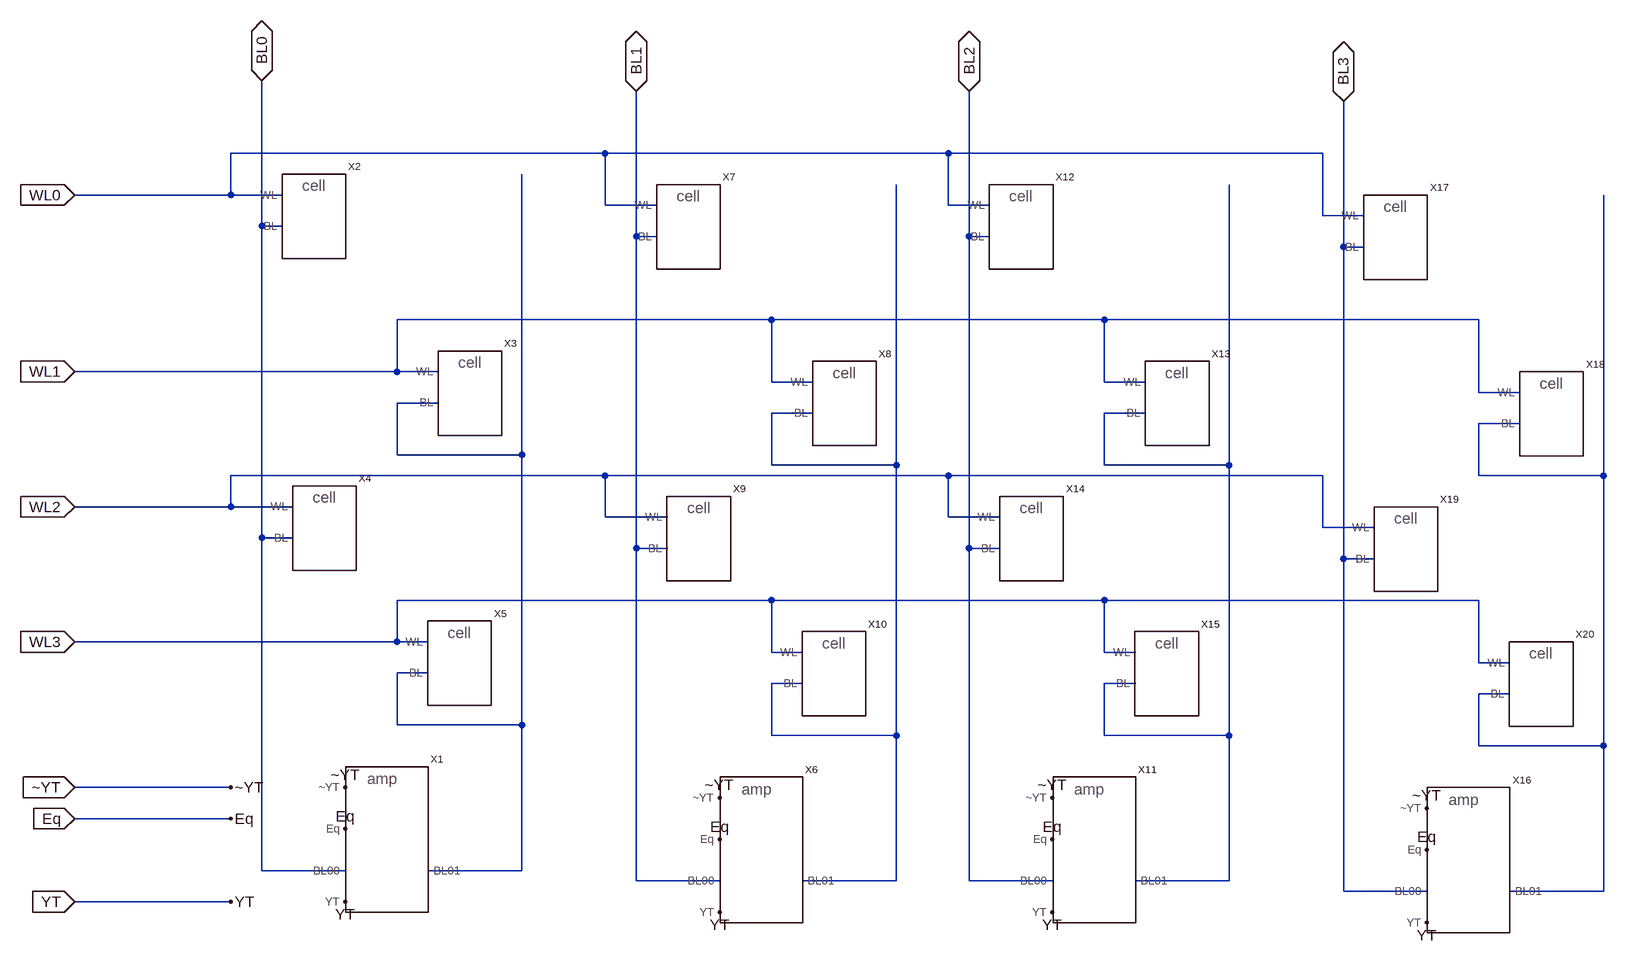
[diagram p0: schematic folded_bitline_array.asc]
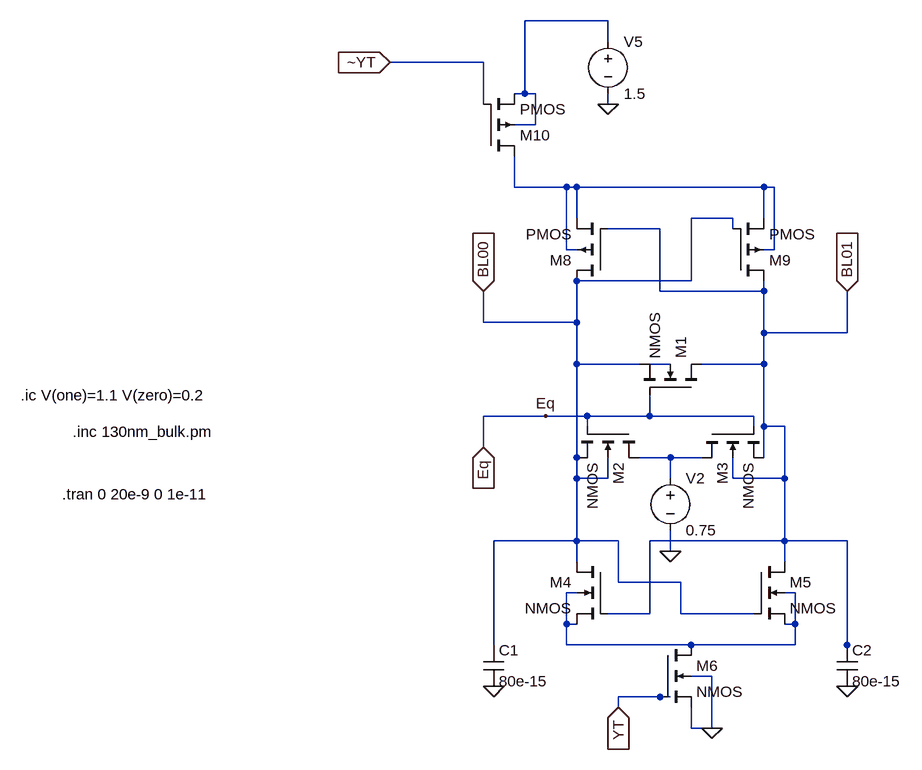
[diagram p1: sub-circuit amplifaer.asc]
folded_bitline_array.asc, the LTspice schematic file:
Version 4
SHEET 1 1560 900
WIRE 16 -528 -560 -528
WIRE 544 -528 16 -528
WIRE 1120 -528 544 -528
WIRE -560 -464 -560 -528
WIRE -560 -464 -800 -464
WIRE -480 -464 -560 -464
WIRE 16 -448 16 -528
WIRE 96 -448 16 -448
WIRE 544 -448 544 -528
WIRE 608 -448 544 -448
WIRE 1120 -432 1120 -528
WIRE 1184 -432 1120 -432
WIRE -512 -416 -512 -640
WIRE -480 -416 -512 -416
WIRE 64 -400 64 -624
WIRE 96 -400 64 -400
WIRE 576 -400 576 -624
WIRE 608 -400 576 -400
WIRE 1152 -384 1152 -608
WIRE 1184 -384 1152 -384
WIRE 272 -272 -304 -272
WIRE 784 -272 272 -272
WIRE 1360 -272 784 -272
WIRE -304 -192 -304 -272
WIRE -304 -192 -800 -192
WIRE -240 -192 -304 -192
WIRE 272 -176 272 -272
WIRE 336 -176 272 -176
WIRE 784 -176 784 -272
WIRE 848 -176 784 -176
WIRE 1360 -160 1360 -272
WIRE 1424 -160 1360 -160
WIRE -240 -144 -304 -144
WIRE 336 -128 272 -128
WIRE 848 -128 784 -128
WIRE 1424 -112 1360 -112
WIRE -304 -64 -304 -144
WIRE -112 -64 -112 -496
WIRE -112 -64 -304 -64
WIRE 272 -48 272 -128
WIRE 464 -48 464 -480
WIRE 464 -48 272 -48
WIRE 784 -48 784 -128
WIRE 976 -48 976 -480
WIRE 976 -48 784 -48
WIRE 16 -32 -560 -32
WIRE 544 -32 16 -32
WIRE 1120 -32 544 -32
WIRE 1360 -32 1360 -112
WIRE 1552 -32 1552 -464
WIRE 1552 -32 1360 -32
WIRE -560 16 -560 -32
WIRE -560 16 -800 16
WIRE -464 16 -560 16
WIRE 16 32 16 -32
WIRE 112 32 16 32
WIRE 544 32 544 -32
WIRE 624 32 544 32
WIRE 1120 48 1120 -32
WIRE 1200 48 1120 48
WIRE -512 64 -512 -416
WIRE -464 64 -512 64
WIRE 64 80 64 -400
WIRE 112 80 64 80
WIRE 576 80 576 -400
WIRE 624 80 576 80
WIRE 1152 96 1152 -384
WIRE 1200 96 1152 96
WIRE 272 160 -304 160
WIRE 784 160 272 160
WIRE 1360 160 784 160
WIRE -304 224 -304 160
WIRE -304 224 -800 224
WIRE -256 224 -304 224
WIRE 272 240 272 160
WIRE 320 240 272 240
WIRE 784 240 784 160
WIRE 832 240 784 240
WIRE 1360 256 1360 160
WIRE 1408 256 1360 256
WIRE -256 272 -304 272
WIRE 320 288 272 288
WIRE 832 288 784 288
WIRE 1408 304 1360 304
WIRE -304 352 -304 272
WIRE -112 352 -112 -64
WIRE -112 352 -304 352
WIRE 272 368 272 288
WIRE 464 368 464 -48
WIRE 464 368 272 368
WIRE 784 368 784 288
WIRE 976 368 976 -48
WIRE 976 368 784 368
WIRE 1360 384 1360 304
WIRE 1552 384 1552 -32
WIRE 1552 384 1360 384
WIRE -560 448 -800 448
WIRE -560 496 -800 496
WIRE -512 576 -512 64
WIRE -384 576 -512 576
WIRE -112 576 -112 352
WIRE -112 576 -256 576
WIRE 64 592 64 80
WIRE 192 592 64 592
WIRE 464 592 464 368
WIRE 464 592 320 592
WIRE 576 592 576 80
WIRE 704 592 576 592
WIRE 976 592 976 368
WIRE 976 592 832 592
WIRE 1152 608 1152 96
WIRE 1280 608 1152 608
WIRE 1552 608 1552 384
WIRE 1552 608 1408 608
WIRE -560 624 -800 624
FLAG -800 -464 WL0
IOPIN -800 -464 In
FLAG -800 -192 WL1
IOPIN -800 -192 In
FLAG -800 16 WL2
IOPIN -800 16 In
FLAG -800 224 WL3
IOPIN -800 224 In
FLAG -512 -640 BL0
IOPIN -512 -640 BiDir
FLAG 64 -624 BL1
IOPIN 64 -624 BiDir
FLAG 576 -624 BL2
IOPIN 576 -624 BiDir
FLAG 1152 -608 BL3
IOPIN 1152 -608 BiDir
FLAG -560 448 ~YT
FLAG -384 448 ~YT
FLAG 192 464 ~YT
FLAG 704 464 ~YT
FLAG 1280 480 ~YT
FLAG -384 512 Eq
FLAG 192 528 Eq
FLAG 704 528 Eq
FLAG 1280 544 Eq
FLAG -560 496 Eq
FLAG -560 624 YT
FLAG -384 624 YT
FLAG 192 640 YT
FLAG 704 640 YT
FLAG 1280 656 YT
FLAG -800 448 ~YT
IOPIN -800 448 In
FLAG -800 496 Eq
IOPIN -800 496 In
FLAG -800 624 YT
IOPIN -800 624 In
SYMBOL amplifaer -272 480 R0
SYMATTR InstName X1
SYMBOL memory_cell -400 -432 R0
SYMATTR InstName X2
SYMBOL memory_cell -160 -160 R0
SYMATTR InstName X3
SYMBOL memory_cell -384 48 R0
SYMATTR InstName X4
SYMBOL memory_cell -176 256 R0
SYMATTR InstName X5
SYMBOL amplifaer 304 496 R0
SYMATTR InstName X6
SYMBOL memory_cell 176 -416 R0
SYMATTR InstName X7
SYMBOL memory_cell 416 -144 R0
SYMATTR InstName X8
SYMBOL memory_cell 192 64 R0
SYMATTR InstName X9
SYMBOL memory_cell 400 272 R0
SYMATTR InstName X10
SYMBOL amplifaer 816 496 R0
SYMATTR InstName X11
SYMBOL memory_cell 688 -416 R0
SYMATTR InstName X12
SYMBOL memory_cell 928 -144 R0
SYMATTR InstName X13
SYMBOL memory_cell 704 64 R0
SYMATTR InstName X14
SYMBOL memory_cell 912 272 R0
SYMATTR InstName X15
SYMBOL amplifaer 1392 512 R0
SYMATTR InstName X16
SYMBOL memory_cell 1264 -400 R0
SYMATTR InstName X17
SYMBOL memory_cell 1504 -128 R0
SYMATTR InstName X18
SYMBOL memory_cell 1280 80 R0
SYMATTR InstName X19
SYMBOL memory_cell 1488 288 R0
SYMATTR InstName X20

amplifaer.asc, the sub-circuit schematic file:
Version 4
SHEET 1 880 680
WIRE 208 -544 80 -544
WIRE 208 -512 208 -544
WIRE 16 -480 -128 -480
WIRE 80 -432 80 -544
WIRE 80 -432 64 -432
WIRE 96 -432 80 -432
WIRE 16 -416 16 -480
WIRE 208 -416 208 -432
WIRE 96 -384 96 -432
WIRE 96 -384 64 -384
WIRE 64 -288 64 -336
WIRE 144 -288 64 -288
WIRE 160 -288 144 -288
WIRE 448 -288 160 -288
WIRE 464 -288 448 -288
WIRE 160 -240 160 -288
WIRE 400 -240 336 -240
WIRE 448 -240 448 -288
WIRE 288 -224 208 -224
WIRE 400 -224 400 -240
WIRE 144 -192 144 -288
WIRE 160 -192 144 -192
WIRE 464 -192 464 -288
WIRE 464 -192 448 -192
WIRE 336 -144 336 -240
WIRE 336 -144 160 -144
WIRE 288 -128 288 -224
WIRE 448 -128 448 -144
WIRE 448 -128 288 -128
WIRE 16 -80 16 -128
WIRE 160 -80 160 -144
WIRE 160 -80 16 -80
WIRE 448 -64 448 -128
WIRE 576 -64 576 -128
WIRE 576 -64 448 -64
WIRE 160 -16 160 -80
WIRE 256 -16 160 -16
WIRE 304 -16 272 -16
WIRE 448 -16 448 -64
WIRE 448 -16 352 -16
WIRE 112 64 16 64
WIRE 176 64 112 64
WIRE 272 64 272 32
WIRE 272 64 176 64
WIRE 432 64 272 64
WIRE 176 80 176 64
WIRE 432 80 432 64
WIRE 448 80 448 -16
WIRE 480 80 448 80
WIRE 16 112 16 64
WIRE 160 128 160 -16
WIRE 304 128 256 128
WIRE 352 128 304 128
WIRE 448 128 448 80
WIRE 160 160 160 128
WIRE 208 160 208 128
WIRE 208 160 160 160
WIRE 304 160 304 128
WIRE 400 160 400 128
WIRE 480 160 480 80
WIRE 480 160 400 160
WIRE 160 256 160 160
WIRE 160 256 32 256
WIRE 224 256 160 256
WIRE 480 256 480 160
WIRE 480 256 272 256
WIRE 576 256 480 256
WIRE 304 272 304 240
WIRE 160 288 160 256
WIRE 480 288 480 256
WIRE 224 320 224 256
WIRE 320 320 224 320
WIRE 160 336 144 336
WIRE 496 336 480 336
WIRE 272 368 272 256
WIRE 272 368 208 368
WIRE 320 368 320 320
WIRE 432 368 320 368
WIRE 144 384 144 336
WIRE 160 384 144 384
WIRE 496 384 496 336
WIRE 496 384 480 384
WIRE 32 416 32 256
WIRE 144 416 144 384
WIRE 336 416 144 416
WIRE 496 416 496 384
WIRE 496 416 336 416
WIRE 576 416 576 256
WIRE 576 432 576 416
WIRE 368 464 336 464
WIRE 288 496 224 496
WIRE 304 496 288 496
WIRE 224 512 224 496
WIRE 336 544 336 512
WIRE 368 544 368 464
WIRE 368 544 336 544
FLAG 304 272 0
FLAG 576 480 0
FLAG 32 480 0
FLAG 368 544 0
FLAG 112 64 Eq
FLAG 208 -416 0
FLAG 16 112 Eq
IOPIN 16 112 In
FLAG -128 -480 ~YT
IOPIN -128 -480 In
FLAG 16 -128 BL00
IOPIN 16 -128 In
FLAG 224 512 YT
IOPIN 224 512 In
FLAG 576 -128 BL01
IOPIN 576 -128 In
SYMBOL nmos4 352 32 M270
SYMATTR InstName M1
SYMATTR Value2 l=130e-9 w=1300e-9 ad=676000e-18 as=676000e-18 pd=3640e-9 ps=3640e-9
SYMBOL nmos4 256 80 R90
SYMATTR InstName M2
SYMATTR Value2 l=130e-9 w=1300e-9 ad=676000e-18 as=676000e-18 pd=3640e-9 ps=3640e-9
SYMBOL nmos4 352 80 M90
SYMATTR InstName M3
SYMATTR Value2 l=130e-9 w=1300e-9 ad=676000e-18 as=676000e-18 pd=3640e-9 ps=3640e-9
SYMBOL voltage 304 144 R0
WINDOW 123 0 0 Left 0
WINDOW 39 0 0 Left 0
SYMATTR InstName V2
SYMATTR Value 0.75
SYMBOL cap 16 416 R0
SYMATTR InstName C1
SYMATTR Value 80e-15
SYMBOL cap 560 416 R0
SYMATTR InstName C2
SYMATTR Value 80e-15
SYMBOL nmos4 208 288 M0
SYMATTR InstName M4
SYMATTR Value2 l=130e-9 w=1300e-9 ad=676000e-18 as=676000e-18 pd=3640e-9 ps=3640e-9
SYMBOL nmos4 432 288 R0
SYMATTR InstName M5
SYMATTR Value2 l=130e-9 w=1300e-9 ad=676000e-18 as=676000e-18 pd=3640e-9 ps=3640e-9
SYMBOL nmos4 288 416 R0
SYMATTR InstName M6
SYMATTR Value2 l=130e-9 w=1300e-9 ad=676000e-18 as=676000e-18 pd=3640e-9 ps=3640e-9
SYMBOL pmos4 208 -144 R180
SYMATTR InstName M8
SYMATTR Value2 l=130e-9 w=2600e-9 ad=676000e-18 as=676000e-18 pd=3640e-9 ps=3640e-9
SYMBOL pmos4 400 -144 M180
SYMATTR InstName M9
SYMATTR Value2 l=130e-9 w=12600e-9 ad=676000e-18 as=676000e-18 pd=3640e-9 ps=3640e-9
SYMBOL pmos4 16 -336 M180
SYMATTR InstName M10
SYMATTR Value2 l=130e-9 w=2600e-9 ad=676000e-18 as=676000e-18 pd=3640e-9 ps=3640e-9
SYMBOL voltage 208 -528 R0
WINDOW 123 0 0 Left 0
WINDOW 39 0 0 Left 0
SYMATTR InstName V5
SYMATTR Value 1.5
TEXT -616 88 Left 2 !.inc 130nm_bulk.pm
TEXT -632 184 Left 2 !.tran 0 20e-9 0 1e-11
TEXT -696 32 Left 2 !.ic V(one)=1.1 V(zero)=0.2

The netlist it stands for:
* folded_bitline_array.asc
XX1 Eq YT ~YT BL0 N001 amplifaer
XX2 WL0 BL0 memory_cell  ; pins WL BL
XX3 WL1 N001 memory_cell  ; pins WL BL
XX4 WL2 BL0 memory_cell  ; pins WL BL
XX5 WL3 N001 memory_cell  ; pins WL BL
XX6 Eq YT ~YT BL1 N002 amplifaer
XX7 WL0 BL1 memory_cell  ; pins WL BL
XX8 WL1 N002 memory_cell  ; pins WL BL
XX9 WL2 BL1 memory_cell  ; pins WL BL
XX10 WL3 N002 memory_cell  ; pins WL BL
XX11 Eq YT ~YT BL2 N003 amplifaer
XX12 WL0 BL2 memory_cell  ; pins WL BL
XX13 WL1 N003 memory_cell  ; pins WL BL
XX14 WL2 BL2 memory_cell  ; pins WL BL
XX15 WL3 N003 memory_cell  ; pins WL BL
XX16 Eq YT ~YT BL3 N004 amplifaer
XX17 WL0 BL3 memory_cell  ; pins WL BL
XX18 WL1 N004 memory_cell  ; pins WL BL
XX19 WL2 BL3 memory_cell  ; pins WL BL
XX20 WL3 N004 memory_cell  ; pins WL BL

* block symbol definitions
.subckt amplifaer Eq YT ~YT BL00 BL01
M1 BL01 Eq BL00 N003 NMOS l=130e-9 w=1300e-9 ad=676000e-18 as=676000e-18 pd=3640e-9 ps=3640e-9
M2 N004 Eq BL00 BL00 NMOS l=130e-9 w=1300e-9 ad=676000e-18 as=676000e-18 pd=3640e-9 ps=3640e-9
M3 N004 Eq BL01 BL01 NMOS l=130e-9 w=1300e-9 ad=676000e-18 as=676000e-18 pd=3640e-9 ps=3640e-9
V2 N004 0 0.75
C1 BL00 0 80e-15
C2 BL01 0 80e-15
M4 BL00 BL01 N005 N005 NMOS l=130e-9 w=1300e-9 ad=676000e-18 as=676000e-18 pd=3640e-9 ps=3640e-9
M5 BL01 BL00 N005 N005 NMOS l=130e-9 w=1300e-9 ad=676000e-18 as=676000e-18 pd=3640e-9 ps=3640e-9
M6 N005 YT 0 0 NMOS l=130e-9 w=1300e-9 ad=676000e-18 as=676000e-18 pd=3640e-9 ps=3640e-9
M8 BL00 BL01 N002 N002 PMOS l=130e-9 w=2600e-9 ad=676000e-18 as=676000e-18 pd=3640e-9 ps=3640e-9
M9 BL01 BL00 N002 N002 PMOS l=130e-9 w=12600e-9 ad=676000e-18 as=676000e-18 pd=3640e-9 ps=3640e-9
M10 N002 ~YT N001 N001 PMOS l=130e-9 w=2600e-9 ad=676000e-18 as=676000e-18 pd=3640e-9 ps=3640e-9
V5 N001 0 1.5
.inc 130nm_bulk.pm
.tran 0 20e-9 0 1e-11
.ic V(one)=1.1 V(zero)=0.2
.ends amplifaer

.model NMOS NMOS
.model PMOS PMOS
.lib standard.mos
.backanno
.end